# EAGLE schematic Lifebud-v2 (EAGLE 8.0.0)
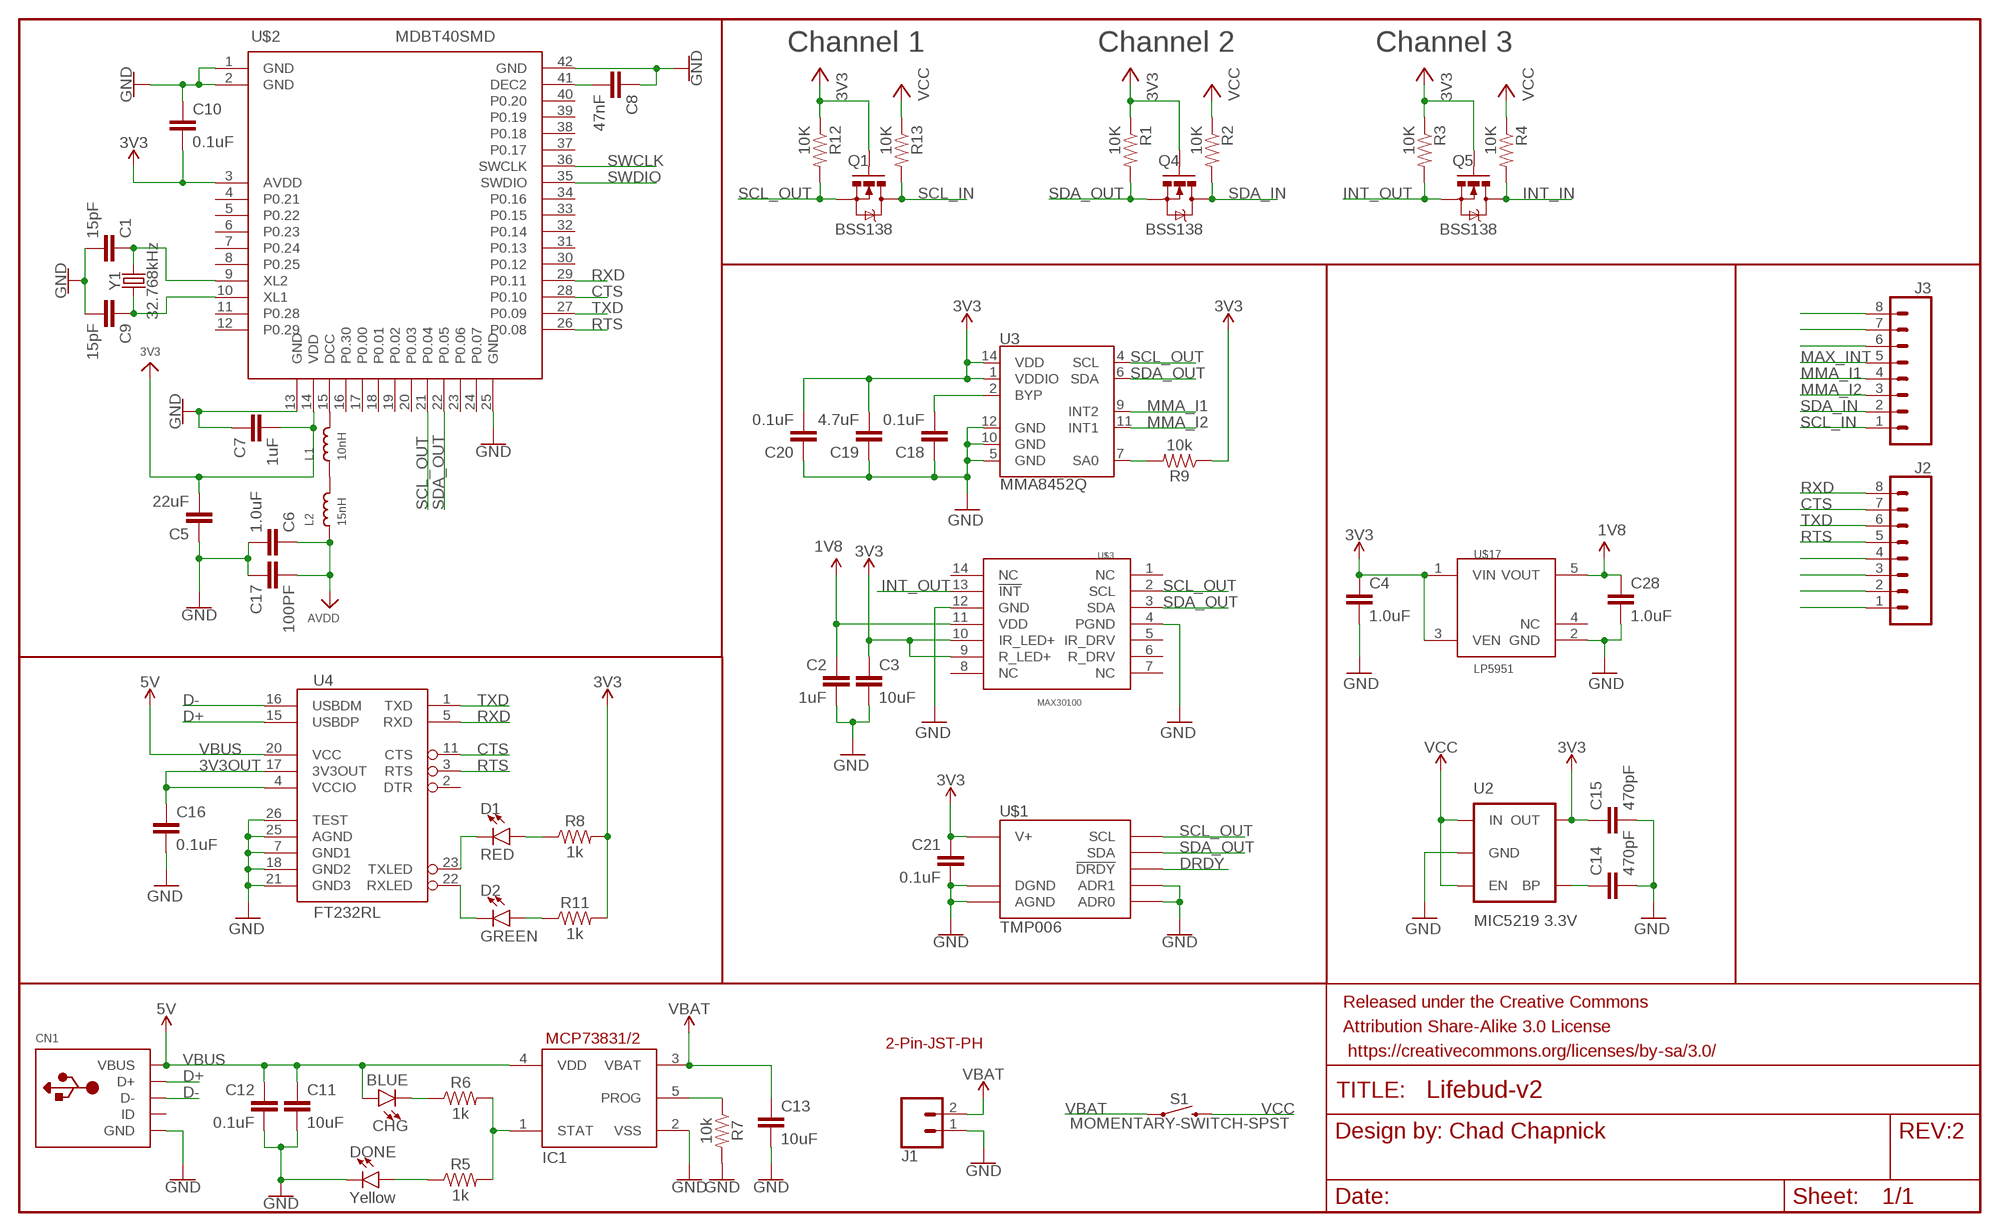
[diagram p0: schematic, sheet 1]

## Parts
C1  15pF  15PF-0402-50V-5%  [0402]
C2  1uF  C-EUC0805  [C0805]
C3  10uF  C-EUC0805  [C0805]
C4  1.0uF  1.0UF-0402-16V-10%  [0402]
C5  22uF  22UF-0805-6.3V-20%  [0805]
C6  1.0uF  1.0UF-0603-16V-10%  [0603]
C7  1uF  1.0UF-0603-16V-10%  [0603]
C8  47nF  47NF-0603-25V-5%  [0603]
C9  15pF  15PF-0402-50V-5%  [0402]
C10  0.1uF  0.1UF-0402-16V-10%  [0402]
C11  10uF  10UF-0603-6.3V-20%  [0603]
C12  0.1uF  0.1UF-0402-16V-10%  [0402]
C13  10uF  10UF-0603-6.3V-20%  [0603]
C14  470pF  470PF-0603-50V-5%  [0603]
C15  470pF  470PF-0603-50V-5%  [0603]
C16  0.1uF  0.1UF-0402-16V-10%  [0402]
C17  100PF  100PF-0402-50V-5%  [0402]
C18  0.1uF  0.1UF-0402-16V-10%  [0402]
C19  4.7uF  4.7UF0603  [0603]
C20  0.1uF  0.1UF-0402-16V-10%  [0402]
C21  0.1uF  0.1UF-0402-16V-10%  [0402]
C28  1.0uF  1.0UF-0402-16V-10%  [0402]
CHG  BLUE  LED-BLUE0603  [LED-0603]
CN1  USBMINIB  [USB-MINIB]
D1  RED  LED-RED0603  [LED-0603]
D2  GREEN  LED-GREEN0603  [LED-0603]
DONE  Yellow  LED-YELLOW0603  [LED-0603]
FRAME1  FRAME-LETTER  [CREATIVE_COMMONS]
IC1  MCP73831/OT  [SOT23-5L]
J1  CONN_02-JST-2MM-SMT  [JST-2-SMD]
J2  CONN_08"  [1X08]
J3  CONN_08"  [1X08]
L1  10nH  INDUCTOR0603  [0603]
L2  15nH  INDUCTOR0603  [0603]
Q1  BSS138  MOSFET-NCHANNELSMD  [SOT23-3]
Q4  BSS138  MOSFET-NCHANNELSMD  [SOT23-3]
Q5  BSS138  MOSFET-NCHANNELSMD  [SOT23-3]
R1  10K  RESISTOR0402-RES  [0402-RES]
R2  10K  RESISTOR0402-RES  [0402-RES]
R3  10K  RESISTOR0402-RES  [0402-RES]
R4  10K  RESISTOR0402-RES  [0402-RES]
R5  1k  1KOHM-0603-1/10W-1%  [0603]
R6  1k  1KOHM-0603-1/10W-1%  [0603]
R7  10k  10KOHM-0603-1/10W-1%  [0603]
R8  1k  1KOHM-0603-1/10W-1%  [0603]
R9  10k  10KOHM-0603-1/10W-1%  [0603]
R11  1k  1KOHM-0603-1/10W-1%  [0603]
R12  10K  RESISTOR0402-RES  [0402-RES]
R13  10K  RESISTOR0402-RES  [0402-RES]
S1  MOMENTARY-SWITCH-SPST  MOMENTARY-SWITCH-SPST-SMD-4.6X2.8MM  [TACTILE_SWITCH_SMD_4.6X2.8MM]
U2  MIC5219 3.3V  V_REG_MIC5219SMD  [SOT23-5]
U3  MMA8452Q  [QFN-16]
U4  FT232RL  FT232RL-BASICSSOP  [SSOP28DB]
U$1  TMP006  [BGA8DS]
U$2  MDBT40SMD  [MDBT40]
U$3  MAX30100  [OESIP-14]
U$17  LP5951  [SC70-5]
Y1  32.768kHz  CRYSTAL-32.768KHZSMD-3.2X1.5  [CRYSTAL-SMD-3.2X1.5MM]

## Nets
1V8: C2.1 C28.1 U$3.11(VDD) U$17.5(VOUT)
3V3: C3.1 C4.1 C5.2 C7.2 C10.2 C15.1 Q1.1(G) Q4.1(G) Q5.1(G) R1.1 R3.1 R8.2 R11.2 R12.1 U2.5(OUT) U$2.3(AVDD) U$2.14(VDD) U$3.9(R_LED+) U$3.10(IR_LED+) U$17.1(VIN) U$17.3(VEN)
3V3OUT: C16.1 U4.4(VCCIO) U4.17(3V3OUT)
AVDD: C6.1 C17.2 L2.1
CTS: J2.7 U4.11(CTS) U$2.28(P0.10)
D+: CN1.D+ U4.15(USBDP)
D-: CN1.D- U4.16(USBDM)
DRDY: U$1.C2(!DRDY)
GND: C1.2 C2.2 C3.2 C4.2 C5.1 C6.2 C7.1 C8.1 C9.2 C10.1 C11.2 C12.2 C13.2 C14.2 C15.2 C16.2 C17.1 C18.1 C19.1 C20.1 C21.2 C28.2 CN1.GND DONE.C IC1.2(VSS) J1.1 R7.2 U2.2(GND) U3.5(GND) U3.10(GND) U3.12(GND) U4.7(GND1) U4.18(GND2) U4.21(GND3) U4.25(AGND) U4.26(TEST) U$1.A1(DGND) U$1.A2(AGND) U$1.B1(ADR1) U$1.C1(ADR0) U$2.1(GND) U$2.2(GND) U$2.13(GND) U$2.25(GND) U$2.42(GND) U$3.4(PGND) U$3.12(GND) U$17.2(GND)
INT_IN: Q5.3(D) R4.2
INT_OUT: Q5.2(S) R3.2 U$3.13(!INT)
MAX_INT: J3.5
MMA_I1: J3.4 U3.9(INT2)
MMA_I2: J3.3 U3.11(INT1)
N$1: J3.8
N$2: C8.2 U$2.41(DEC2)
N$3: C9.1 U$2.10(XL1) Y1.P$1
N$4: C1.1 U$2.9(XL2) Y1.P$2
N$5: IC1.1(STAT) R5.2 R6.2
N$6: DONE.A R5.1
N$7: CHG.C R6.1
N$8: IC1.5(PROG) R7.1
N$9: C14.1 U2.4(BP)
N$10: D1.A R8.1
N$11: J3.7
N$12: D2.A R11.1
N$13: D1.C U4.23(TXLED)
N$14: D2.C U4.22(RXLED)
N$16: J3.6
N$20: L1.1 L2.2
N$22: L1.2 U$2.15(DCC)
N$23: J2.4
N$24: C18.2 U3.2(BYP)
N$25: R9.2 U3.7(SA0)
N$26: J2.3
N$27: J2.2
N$28: J2.1
RTS: J2.5 U4.3(RTS) U$2.26(P0.08)
RXD: J2.8 U4.5(RXD) U$2.29(P0.11)
SCL_IN: J3.1 Q1.3(D) R13.2
SCL_OUT: Q1.2(S) R12.2 U3.4(SCL) U$1.B3(SCL) U$2.21(P0.04) U$3.2(SCL)
SDA_IN: J3.2 Q4.3(D) R2.2
SDA_OUT: Q4.2(S) R1.2 U3.6(SDA) U$1.C3(SDA) U$2.22(P0.05) U$3.3(SDA)
SWCLK: U$2.36(SWCLK)
SWDIO: U$2.35(SWDIO)
TXD: J2.6 U4.1(TXD) U$2.27(P0.09)
VBAT: C13.1 IC1.3(VBAT) J1.2 S1.1 S1.2
VBUS: C11.1 C12.1 CHG.A CN1.VBUS IC1.4(VDD) U4.20(VCC) ; supply symbol labelled 5V
VCC: C19.2 C20.2 C21.1 R2.1 R4.1 R9.1 R13.1 S1.3 S1.4 U2.1(IN) U2.3(EN) U3.1(VDDIO) U3.14(VDD) U$1.A3(V+) ; supply symbol labelled 3V3
Unconnected: CN1.ID U4.2(DTR) U$2.4(P0.21) U$2.5(P0.22) U$2.6(P0.23) U$2.7(P0.24) U$2.8(P0.25) U$2.11(P0.28) U$2.12(P0.29) U$2.16(P0.30) U$2.17(P0.00) U$2.18(P0.01) U$2.19(P0.02) U$2.20(P0.03) U$2.23(P0.06) U$2.24(P0.07) U$2.30(P0.12) U$2.31(P0.13) U$2.32(P0.14) U$2.33(P0.15) U$2.34(P0.16) U$2.37(P0.17) U$2.38(P0.18) U$2.39(P0.19) U$2.40(P0.20) U$3.1(NC) U$3.5(IR_DRV) U$3.6(R_DRV) U$3.7(NC) U$3.8(NC) U$3.14(NC) U$17.4(NC)

## Notes on the sheet
- Channel 1 | Channel 2 | Channel 3
- 2-Pin-JST-PH

## Library data of the parts
C1 C9 = SparkFun-Capacitors:15PF: 15pF ceramic capacitors A capacitor is a passive two-terminal electrical component used to store electrical energy temporarily in an electric field.; PROD_ID: CAP-13063
C2 C3 = rcl:C-EU: CAPACITOR, European symbol
C4 C28 = SparkFun-Capacitors:1.0UF: 1µF ceramic capacitors A capacitor is a passive two-terminal electrical component used to store electrical energy temporarily in an electric field.; PROD_ID: CAP-12417
C5 = SparkFun-Capacitors:22UF: 22µF ceramic capacitors A capacitor is a passive two-terminal electrical component used to store electrical energy temporarily in an electric field.; PROD_ID: CAP-08402
C6 = SparkFun-Capacitors:1.0UF: 1µF ceramic capacitors A capacitor is a passive two-terminal electrical component used to store electrical energy temporarily in an electric field.; PROD_ID: CAP-00868
C7 = SparkFun-Capacitors:1.0UF: 1µF ceramic capacitors A capacitor is a passive two-terminal electrical component used to store electrical energy temporarily in an electric field.; PROD_ID: CAP-00868; VALUE: 1.0uF
C8 = SparkFun-Capacitors:47NF: 47nF ceramic capacitors A capacitor is a passive two-terminal electrical component used to store electrical energy temporarily in an electric field.; PROD_ID: CAP-08605
C10 C12 C16 C18 C20 C21 = SparkFun-Capacitors:0.1UF: 0.1µF ceramic capacitors A capacitor is a passive two-terminal electrical component used to store electrical energy temporarily in an electric field.; PROD_ID: CAP-12416
C11 C13 = SparkFun-Capacitors:10UF: 10.0µF ceramic capacitors A capacitor is a passive two-terminal electrical component used to store electrical energy temporarily in an electric field.; PROD_ID: CAP-11015
C14 C15 = SparkFun-Capacitors:470PF: 470pF ceramic capacitors A capacitor is a passive two-terminal electrical component used to store electrical energy temporarily in an electric field.; PROD_ID: CAP-07884
C17 = SparkFun-Capacitors:100PF: 100pF/0.1nF ceramic capacitors A capacitor is a passive two-terminal electrical component used to store electrical energy temporarily in an electric field.; PROD_ID: CAP-13458
C19 = SparkFun-Capacitors:4.7UF: 4.7µF ceramic capacitors A capacitor is a passive two-terminal electrical component used to store electrical energy temporarily in an electric field.; PROD_ID: CAP-08280
CHG = SparkFun-LED:LED-BLUE: Blue SMD LED Used in manufacturing of various products at SparkFun Packages: 0603 - SMD 0603 package [Product Link] <http://www.digikey.com/product-detail/en/SMLE12BC7TT86/511-1589-2-ND/1641808> 1206 - SMD1206 package [Product Link] <http://www.digikey.com/product-detail/en/lite-on-inc/LTST-C150TBKT/160-1643-1-ND/573584> SparkFun Products: ESP8266 Thing-Dev Board <https://www.sparkfun.com/products/13711> RedBoard <https://www.sparkfun.com/products/12757>; PROD_ID: DIO-08575
CN1 = adafruit:USB: USB Connectors USBMINIB - Surface Mount Female Mini-B USB Connector 4UConnector: 06564 By microbuilder.eu Thru-hole RA Female Mini-B USB Connector 4UConnector: 18732 By ladyada.net
D1 = SparkFun-LED:LED-RED: Red SMD LED Used in manufacturing of most products at SparkFun Packages: 0603 - SMD 0603 package [Product Link] <http://docs.avagotech.com/docs/AV02-0551EN> 0603 SMART - SMD 0603 SMART package ( more efficient and expensive)[Product Link] <http://www.osram-os.com/Graphics/XPic2/00077099_0.pdf> 1206 - SMD1206 package [Product Link] <https://www.sparkfun.com/datasheets/DevTools/LilyPad/Q150OVS4.pdff> SparkFun Products: Pro Mini 328 -5V <https://www.sparkfun.com/products/821> RedBoard <https://www.sparkfun.com/products/12757> IOIO-OTG <https://www.sparkfun.com/products/13613>; PROD_ID: DIO-00819
D2 = SparkFun-LED:LED-GREEN: Green SMD LED Used in manufacturing of various products at SparkFun Packages: 0603 - SMD 0603 package [Product Link] <http://www.futureelectronics.com/en/technologies/semiconductors/optoelectronics/leds/Pages/9894312-LTST-C190GKT.aspx?CrossPart=HSMG-C190&IM=0> LilyPad 1206 - SMD1206 LilyPad package [Product Link] <http://www.futureelectronics.com/en/Technologies/Product.aspx?ProductID=IN150NGHARVATEKCORPORATION2049943&IM=0> 1206 - SMD1206 package [Product Link] <http://www.futureelectronics.com/en/technologies/semiconductors/optoelectronics/leds/Pages/8315665-LTST-C150KGKT.aspx?IM=0> 1206 Bottom Mount -SMD 1206 Bottom Mount [Product Link] <http://www.digikey.com/product-detail/en/lite-on-inc/LTST-C230KGKT/160-1456-1-ND/386854> SparkFun Products: Pro Mini 328 -5V <https://www.sparkfun.com/products/821> RedBoard <https://www.sparkfun.com/products/12757> MP3 Trigger <https://www.sparkfun.com/products/13720> Makey Makey <https://www.sparkfun.com/products/11076>; PROD_ID: DIO-00821
DONE = SparkFun-LED:LED-YELLOW: Yellow SMD LED Used in manufacturing several products at SparkFun. Packages: 0603 - SMD 0603 package[Product Link] <http://www.kingbrightusa.com/product.asp?catalog_name=LED&product_id=APT1608SYCK> 0603 -SMART - SMART SMD 0603 package (more efficient/more expensive) [Product Link] <http://www.osram-os.com/osram_os/en/products/product-catalog/led-light-emitting-diodes/smartled-0603/ly-l29k/index.jsp> LilyPad - SMD1206 package[Product Datasheet] <https://www.sparkfun.com/datasheets/DevTools/LilyPad/Q150YUS4.pdf> SparkFun Products: Blynk Board <https://www.sparkfun.com/products/13794> IOIO-OTG <https://www.sparkfun.com/products/13613> XBee Explorer Serial <https://www.sparkfun.com/products/13225>; PROD_ID: DIO-09003
FRAME1 = SparkFun-Retired:FRAME-LETTER: Schematic Frame Standard 8.5x11 US Letter frame
IC1 = adafruit:MCP73831: MCP73831/2 Miniature Single-Cell, Fully Integrated Li-Ion, Li-Polymer Charge Management Controllers. Nice and small simple lipoly charge controller, with adjustable current and status output (LED) http://www.ladyada.net/library/pcb/eaglelibrary.html
J1 = SparkFun-Connectors:CONN_02: Multi connection point. Often used as Generic Header-pin footprint for 0.1 inch spaced/style header connections On any of the 0.1 inch spaced packages, you can populate with these: Break Away Headers - Straight <https://www.sparkfun.com/products/116> (PRT-00116) Break Away Male Headers - Right Angle <https://www.sparkfun.com/products/553> (PRT-00553) Female Headers <https://www.sparkfun.com/products/115> (PRT-00115) Break Away Headers - Machine Pin <https://www.sparkfun.com/products/117> (PRT-00117) Break Away Female Headers - Swiss Machine Pin <https://www.sparkfun.com/products/743> (PRT-00743) For SCREWTERMINALS and SPRING TERMINALS visit here: Screw Terimnals on SparkFun.com <https://www.sparkfun.com/search/results?term=Screw+Terminals> (5mm/3.5mm/2.54mm spacing) This device is also useful as a general connection point to wire up your design to another part of your project. Our various solder wires solder well into these plated through hole pads. Hook-Up Wire - Assortment (Stranded, 22 AWG) <https://www.sparkfun.com/products/11375> (PRT-11375) Hook-Up Wire - Assortment (Solid Core, 22 AWG) <https://www.sparkfun.com/products/11367> (PRT-11367) View the entire wire category on our website here <https://www.sparkfun.com/categories/141> Special notes: Molex polarized connector foot print use with: PRT-08233 with associated crimp pins and housings. 2.54_SCREWTERM for use with PRT-10571. 3.5mm Screw Terminal footprints for PRT-08084 5mm Screw Terminal footprints for use with PRT-08432; PROD_ID: CONN-11443
J2 J3 = SparkFun-Connectors:CONN_08: Multi connection point. Often used as Generic Header-pin footprint for 0.1 inch spaced/style header connections On any of the 0.1 inch spaced packages, you can populate with these: Break Away Headers - Straight <https://www.sparkfun.com/products/116> (PRT-00116) Break Away Male Headers - Right Angle <https://www.sparkfun.com/products/553> (PRT-00553) Female Headers <https://www.sparkfun.com/products/115> (PRT-00115) Break Away Headers - Machine Pin <https://www.sparkfun.com/products/117> (PRT-00117) Break Away Female Headers - Swiss Machine Pin <https://www.sparkfun.com/products/743> (PRT-00743) Arduino Stackable Header - 8 Pin <https://www.sparkfun.com/products/9279> (PRT-09279) For SCREWTERMINALS and SPRING TERMINALS visit here: Screw Terimnals on SparkFun.com <https://www.sparkfun.com/search/results?term=Screw+Terminals> (5mm/3.5mm/2.54mm spacing) This device is also useful as a general connection point to wire up your design to another part of your project. Our various solder wires solder well into these plated through hole pads. Hook-Up Wire - Assortment (Stranded, 22 AWG) <https://www.sparkfun.com/products/11375> (PRT-11375) Hook-Up Wire - Assortment (Solid Core, 22 AWG) <https://www.sparkfun.com/products/11367> (PRT-11367) View the entire wire category on our website here <https://www.sparkfun.com/categories/141> Special notes: Molex polarized connector foot print use with SKU : PRT-08231 with associated crimp pins and housings. 1MM SMD Version SKU: PRT-10208 NOTES ON THE VARIANTS LOCK and LOCK_LONGPADS... This footprint was designed to help hold the alignment of a through-hole component (i.e. 6-pin header) while soldering it into place. You may notice that each hole has been shifted either up or down by 0.005 of an inch from it's more standard position (which is a perfectly straight line). This slight alteration caused the pins (the squares in the middle) to touch the edges of the holes. Because they are alternating, it causes a "brace" to hold the component in place. 0.005 has proven to be the perfect amount of "off-center" position when using our standard breakaway headers. Although looks a little odd when you look at the bare footprint, once you have a header in there, the alteration is very hard to notice. Also,if you push a header all the way into place, it is covered up entirely on the bottom side.; PROD_ID: CONN-08438
L1 L2 = microbuilder:INDUCTOR: Inductors 0603: 10nH Ceramic Inductor - microwire antenna/RF (Digikey: 712-1434-2-ND) 0805: 560nH Ceramic Inductor - RF (Digikey: 553-1047-1-ND) 270nH Ceramic Inductor - Q = 40@250MHz, +-5%, 1 Ohm DC Resistance (Digikey: 535-10506-2-ND) 1007 (2518 Metric) SMT: 10µH 10% 250mOhm 820mA 1007 Inductor (Digikey: 587-2189-1-ND) 22µH 10% 500mOhm 580mA 1007 Inductor (Digikey: 587-2190-1-ND) 47µH 10% 950mOhm 420mA 1007 Inductor (Digikey: 587-2191-1-ND) 47µH 5% 100mOhm 1A 1008 Inductor (Digikey: 732-1816-1-ND) 5.0x5.0mm (Taiyo Yuden NR5040 Series) 6.8µH 20% 2.3A 64mOhm Inductor (Digikey: 587-2374-2-ND) 5.0x5.0mm (TDK VLC5045 Series) 4.7µH 20% 3.3A 34mOhm Inductor (Digikey: 445-6526-1-ND) 6.8µH 20% 2.7A 46mOhm Inductor (Digikey: 445-6527-1-ND) 6.0x6.0mm (TDK VLC6045 Series) 4.7µH 20% 3.8A 27mOhm Inductor (Digikey: 445-6538-2-ND) 6.8µH 20% 3A 41mOhm Inductor (Digikey: 445-6540-1-ND) 6.2µH 30% 2.2A 45mOhm Inductor (Digikey: SRR5028-6R2YCT-ND) - Not TDK VLC6045 but footprint should match 6.0x6.0mm (TDK SLF6045 Series) 6.8uH 30% 2A 33mOhm Inductor (Digikey: 445-4572-1-ND, Mouser: 810-SLF645T6R8N2R0PF)
Q1 Q4 Q5 = SparkFun:MOSFET-NCHANNEL
R1-R4 R12 R13 = SparkFun:RESISTOR: Resistor Basic schematic elements and footprints for 0603, 1206, and PTH resistors.
R5 R6 R8 R11 = SparkFun-Resistors:1KOHM: 1kΩ resistor A resistor is a passive two-terminal electrical component that implements electrical resistance as a circuit element. Resistors act to reduce current flow, and, at the same time, act to lower voltage levels within circuits. - Wikipedia; PROD_ID: RES-07856
R7 R9 = SparkFun-Resistors:10KOHM: 10kΩ resistor A resistor is a passive two-terminal electrical component that implements electrical resistance as a circuit element. Resistors act to reduce current flow, and, at the same time, act to lower voltage levels within circuits. - Wikipedia; PROD_ID: RES-00824
S1 = SparkFun-Switches:MOMENTARY-SWITCH-SPST: Momentary Switch (Pushbutton) - SPST Normally-open (NO) SPST momentary switches (buttons, pushbuttons). Variants PTH-12MM - 12mm square, through-hole Momentary Pushbutton Switch - 12mm Square <https://www.sparkfun.com/products/9190> (COM-09190) PTH-6.0MM, PTH-6.0MM-KIT - 6.0mm square, through-hole Mini Pushbutton Switch <https://www.sparkfun.com/products/97> (COM-00097) KIT package intended for soldering kit's - only one side of pads' copper is exposed. PTH-RIGHT-ANGLE-KIT - Right-angle, through-hole Right Angle Tactile Button <https://www.sparkfun.com/products/10791> - Used on SparkFun BigTime Watch Kit <https://www.sparkfun.com/products/11734> SMD-12MM - 12mm square, surface-mount Tactile Button - SMD (12mm) <https://www.sparkfun.com/products/12993> (COM-12993) Used on SparkFun PicoBoard <https://www.sparkfun.com/products/11888> SMD-4.5MM - 4.5mm Square Trackball Switch Used on SparkFun Blackberry Trackballer Breakout <https://www.sparkfun.com/products/13169> SMD-4.6MMX2.8MM - 4.60mm x 2.80mm, surface mount Used on SparkFun SAMD21 Mini Breakout <https://www.sparkfun.com/products/13664> SMD-5.2MM, SMD-5.2-REDUNDANT - 5.2mm square, surface-mount Mini Pushbutton Switch - SMD <https://www.sparkfun.com/products/8720> (COM-08720) Used on Arduino Pro Mini <https://www.sparkfun.com/products/11114> REDUNDANT package connects both switch circuits together SMD-6.0X3.5MM - 6.0 x 3.5mm, surface mount Momentary Reset Switch SMD <https://www.sparkfun.com/products/8229> (COM-08229) SMD-6.2MM-TALL - 6.2mm square, surface mount Tactile Button - SMD (6mm) <https://www.sparkfun.com/products/12992> Used on SparkFun Digital Sandbox <https://www.sparkfun.com/products/12651> SMD-RIGHT-ANGLE - Right-angle, surface mount Used on SparkFun Block for Intel® Edison - Arduino <https://www.sparkfun.com/products/13036>; PROD_ID: SWCH-13065
U2 = SparkFun-PowerIC:V_REG_MIC5219: V_REG MIC5219 Standard 500mA LDO voltage regulator in SOT-23 layout. Micrel part MIC5219. BP (by-pass) pin is used to lower output noise with 470pF cap, may be left open.
U3 = SparkFun-Sensors:MMA8452Q: NXP MMA8452Q 3-Axis Digital Accelerometer The MMA8452Q is a smart low-power, three-axis, capacitive MEMS accelerometer with 12 bits of resolution. This accelerometer is packed with embedded functions with flexible user programmable options, configurable to two interrupt pins. Supply Voltage: 1.6-3.6V Range: +/- 2g, 4g, 8g Interface: I2C, 12-bit and 8-bit ODR: 1.56 Hz - 800 Hz Package: QFN-16 Datasheet <http://cache.freescale.com/files/sensors/doc/data_sheet/MMA8452Q.pdf> SparkFun Products SparkFun Triple Axis Accelerometer Breakout - MMA8452Q <https://www.sparkfun.com/products/12756> (SEN-12756) SparkFun RedBot Sensor - Accelerometer <https://www.sparkfun.com/products/12589> (SEN-12589); PROD_ID: IC-10769
U4 = SparkFun-IC-Comms:FT232RL-BASIC: FT232RL USB UART This is the simplified version of the FT232RL unit. Only what you need, nothing you don't. FT232RL 4th Generation USB UART (USB <-> Serial) Controller. Datasheet <http://www.sparkfun.com/datasheets/IC/FT232R_v104.pdf> SparkFun Products Component <https://www.sparkfun.com/products/650> (COM-00650) SparkFun RedBot Mainboard <https://www.sparkfun.com/products/12097> (ROB-12097) SparkFun FTDI Basic Breakout - 5V <https://www.sparkfun.com/products/9716> (DEV-09716) SparkFun FTDI Basic Breakout - 3.3V <https://www.sparkfun.com/products/9873> (DEV-09873) Bus Pirate - v3.6a <https://www.sparkfun.com/products/12942> (TOL-12942) SparkFun USB to Serial Breakout - FT232RL <https://www.sparkfun.com/products/12731> (BOB-12731) SparkFun PicoBoard <https://www.sparkfun.com/products/11888> (WIG-11888) SparkFun RFID USB Reader <https://www.sparkfun.com/products/9963> (SEN-09963) LilyPad FTDI Basic Breakout - 5V <https://www.sparkfun.com/products/10275> (DEV-10275) SparkFun Stepoko <https://www.sparkfun.com/products/13899> (ROB-13899); PROD_ID: IC-00870
U$1 = SparkFun-Sensors:TMP006: Infrared Temperature Sensor TMP006 3.3v to 5.0v Datasheet <http://cdn.sparkfun.com/datasheets/Sensors/Temp/tmp006.pdf> SparkFun Products SparkFun Infrared Temperature Breakout - TMP006 <https://www.sparkfun.com/products/11859> (SEN-11859); PROD_ID: IC-11632
U$2 = MDBT40-v2-bluzDK:MDBT40
U$3 = circuitects:MAX30100
U$17 = circuitects:LP5951
Y1 = SparkFun-Clocks:CRYSTAL-32.768KHZ: 32.768kHz Crystal Frequency: 32.768kHz Frequency Stability: ±20ppm Load Capacitance: 12.5pF (PTH-2X6 & SMD-3.2X1.5), 6pF (SMD-2X6) SparkFun Products: SparkFun BigTime Watch Kit <https://www.sparkfun.com/products/11734> SparkFun nRF52832 Breakout <https://www.sparkfun.com/products/13990> SparkFun Real Time Clock Module <https://www.sparkfun.com/products/12708>; PROD_ID: XTAL-13062